# Altium schematic sheet opa313.SchDoc
size A4
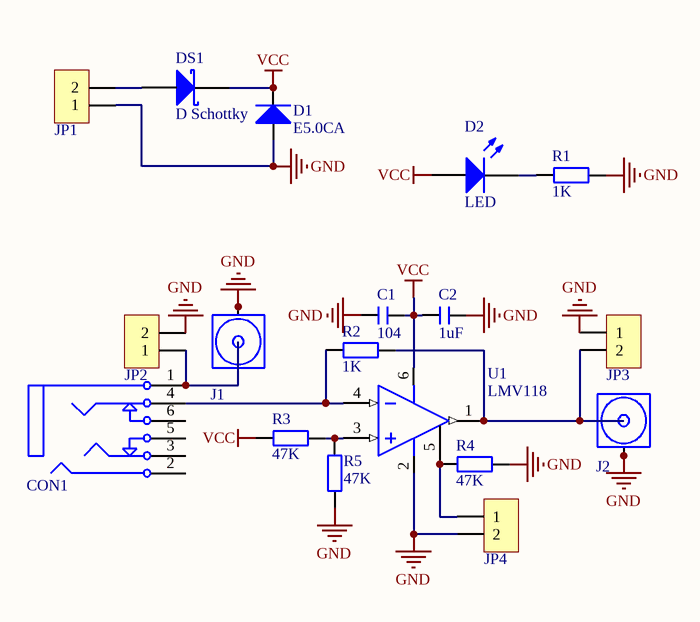
[diagram p0: opa313.SchDoc]

## Parts
C1  104  [C 0603]
C2  1uF  [C 0603]
CON1  PJ342  [PJ342A]  (value not drawn)
D1  Type: E5.0CA  [DIODE-SMA]  (hidden comment: TVS)
D2  LED  [0603]
DS1  D Schottky  [DIODE-SMA]
J1  COAX  [MCX5.08-5-H]  (value not drawn)
J2  COAX  [MCX5.08-5-H]  (value not drawn)
JP1  HDR-1X2  [XH2.54-2P_H]  (value not drawn)
JP2  HDR-1X2  [HDR-1X2]  (value not drawn)
JP3  HDR-1X2  [HDR-1X2]  (value not drawn)
JP4  HDR-1X2  [HDR-1X2]  (value not drawn)
R1  1K  [R 0603]
R2  1K  [R 0805]
R3  47K  [R 0603]
R4  47K  [R 0603]
R5  47K  [R 0603]
U1  LMV118  [SOT23-6_N]

## Nets
GND: C1.1 C2.2 D1.1(A) J1.2(GND) J1.3(GND) J1.4(GND) J1.5(GND) J2.2(GND) J2.3(GND) J2.4(GND) J2.5(GND) JP1.1 JP2.2 JP3.1 JP4.2 R1.2 R4.2 R5.1 U1.2(V-)
VCC: C1.2 C2.1 D1.2(K) D2.1(A) DS1.2 R3.1 U1.6(V+)
NetCON1_1: CON1.1 J1.1(Signal) JP2.1
NetCON1_4: CON1.4 R2.1 U1.4(IN-)
NetD2_2: D2.2(K) R1.1
NetDS1_1: DS1.1 JP1.2
NetJ2_1: J2.1(Signal) JP3.2 R2.2 U1.1(OUT)
NetJP4_1: JP4.1 R4.1 U1.5(SD)
NetR3_2: R3.2 R5.2 U1.3(IN+)

Not connected (* = marked no-connect by the designer): CON1 2 3 5 6

## Library data of the parts
C1 C2 = C: 无极性贴片电容; 版权归属: 源创客; BOM名称: 无极性贴片电容; 学习资源: www.ooocke.com
CON1 = PJ342: 3.5耳机插座,4Pin; BOM名称: 耳机插座; 版权归属: 源创客; 学习资源: www.ooocke.com
D1 = TVS: TVS保护; Published: 8-Jun-2000; LatestRevisionDate: 17-Jul-2002; LatestRevisionNote: Re-released for DXP Platform.; PackageDocument: Sep-1996; PackageReference: SMC; Publisher: Altium Limited; Code_JEDEC: DO-214-AB
D2 = LED: 发光二极管; Published: 8-Jun-2000; LatestRevisionDate: 08-Jul-2005; LatestRevisionNote: Mech Layer 1 removed.; PackageReference: LED; Publisher: Altium Limited
DS1 = D Schottky: Schottky Diode; Published: 8-Jun-2000; LatestRevisionDate: 17-Jul-2002; LatestRevisionNote: Re-released for DXP Platform.; PackageReference: SMB; Publisher: Altium Limited; PackageDescription: DO-214-AA/SMB; 2 C-Bend Leads; Body 5.3 x 3.6 mm, inc. leads (LxW); Code_JEDEC: DO-214-AA
JP1-JP4 = Header 2: 2P接插件; 版权归属: 源创客; BOM名称: 2P接插件; 学习资源: www.ooocke.com
R1-R5 = R: 贴片电阻; 版权归属: 源创客; BOM名称: 贴片电阻; 学习资源: www.ooocke.com
U1 = LMV118: 具有关断功能的LMV11x 低电压45MHz 轨至轨输出运算放大器